# EAGLE design Thunderboard (EAGLE 9.2.2)
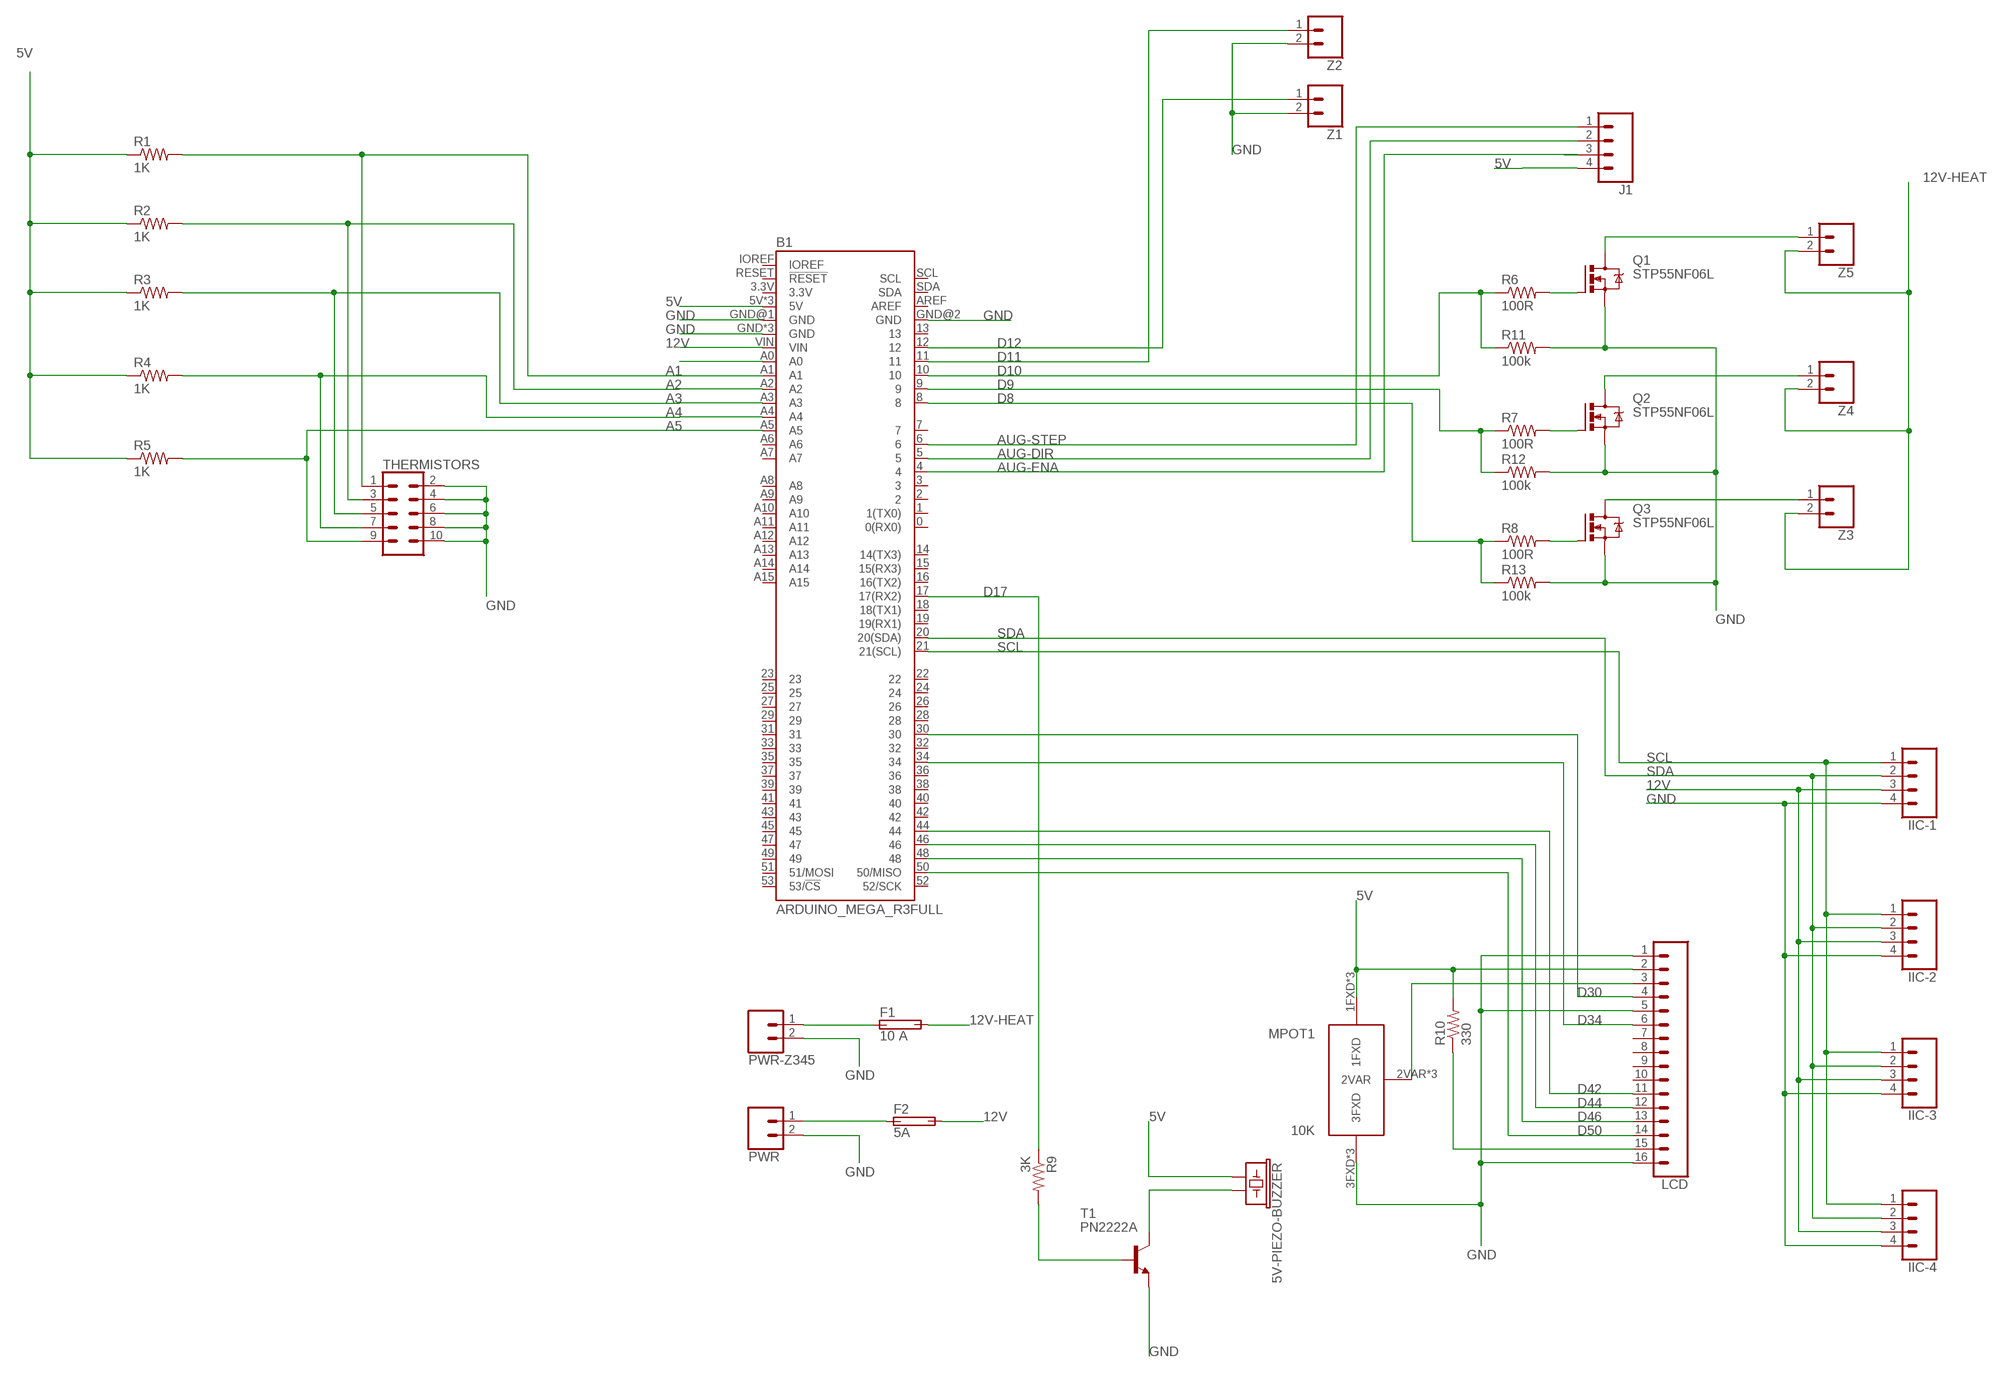
[diagram p0: schematic, sheet 1]

## Parts
5V-PIEZO-BUZZER  BUZZER-PTH  [BUZZER-12MM]
B1  ARDUINO_MEGA_R3FULL  [ARDUINO_MEGA_NO_SILK]
F1  10 A  BLADE-FUSE-HOLDER3557-15  [MINI-BLADE]
F2  5A  BLADE-FUSE-HOLDER3557-15  [MINI-BLADE]
IIC-1  CONN_04  [1X04]
IIC-2  CONN_04  [1X04]
IIC-3  CONN_04  [1X04]
IIC-4  CONN_04  [1X04]
J1  CONN_04  [1X04]
LCD  CONN_16  [1X16]
MPOT1  10K  POT-MULTI-PACKAGE  [POT-MULTI-PACKAGE]
PWR  CONN_023.5MM  [SCREWTERMINAL-3.5MM-2]
PWR-Z345  CONN_023.5MM  [SCREWTERMINAL-3.5MM-2]
Q1  STP55NF06L  [TO-220]
Q2  STP55NF06L  [TO-220]
Q3  STP55NF06L  [TO-220]
R1  1K  R-US_0207/7  [0207/7]
R2  1K  R-US_0207/7  [0207/7]
R3  1K  R-US_0207/7  [0207/7]
R4  1K  R-US_0207/7  [0207/7]
R5  1K  R-US_0207/7  [0207/7]
R6  100R  R-US_0207/7  [0207/7]
R7  100R  R-US_0207/7  [0207/7]
R8  100R  R-US_0207/7  [0207/7]
R9  3K  R-US_0207/7  [0207/7]
R10  330  R-US_0207/7  [0207/7]
R11  100k  R-US_0207/7  [0207/7]
R12  100k  R-US_0207/7  [0207/7]
R13  100k  R-US_0207/7  [0207/7]
T1  PN2222A  -NPN-TO92-EBC  [TO92-EBC]
THERMISTORS  CONN_05X2NO_SILK  [2X5_NOSILK]
Z1  CONN_02  [1X02]
Z2  CONN_02  [1X02]
Z3  CONN_023.5MM  [SCREWTERMINAL-3.5MM-2]
Z4  CONN_023.5MM  [SCREWTERMINAL-3.5MM-2]
Z5  CONN_023.5MM  [SCREWTERMINAL-3.5MM-2]

## Nets
5V: 5V-PIEZO-BUZZER.+ B1.5V B1.5V@1(5V) B1.5V@2(5V) J1.4 LCD.2 MPOT1.1FXD MPOT1.P$7(1FXD) MPOT1.P$8(1FXD) R1.1 R2.1 R3.1 R4.1 R5.1 R10.2
12V: B1.VIN F2.2A F2.2B IIC-1.3 IIC-2.3 IIC-3.3 IIC-4.3
12V-HEAT: F1.2A F1.2B Z3.2 Z4.2 Z5.2
A1: B1.A1 R1.2 THERMISTORS.1
A2: B1.A2 R2.2 THERMISTORS.3
A3: B1.A3 R3.2 THERMISTORS.5
A4: B1.A4 R4.2 THERMISTORS.7
A5: B1.A5 R5.2 THERMISTORS.9
AUG-DIR: B1.5 J1.2
AUG-ENA: B1.4 J1.3
AUG-STEP: B1.6 J1.1
D8: B1.8 R8.1 R13.1
D9: B1.9 R7.1 R12.1
D10: B1.10 R6.1 R11.1
D11: B1.11 Z2.1
D12: B1.12 Z1.1
D17: B1.17(17(RX2)) R9.1
D30: B1.30 LCD.4
D34: B1.34 LCD.6
D42: B1.44 LCD.11
D44: B1.46 LCD.12
D46: B1.48 LCD.13
D50: B1.50(50/MISO) LCD.14
GND: B1.GND B1.GND@1(GND) B1.GND@2(GND) B1.GND@3(GND) B1.GND@4(GND) IIC-1.4 IIC-2.4 IIC-3.4 IIC-4.4 LCD.1 LCD.5 LCD.16 MPOT1.3FXD MPOT1.P$4(3FXD) MPOT1.P$5(3FXD) PWR-Z345.2 PWR.2 Q1.S Q2.S Q3.S R11.2 R12.2 R13.2 T1.E THERMISTORS.2 THERMISTORS.4 THERMISTORS.6 THERMISTORS.8 THERMISTORS.10 Z1.2 Z2.2
N$1: 5V-PIEZO-BUZZER.- T1.C
N$2: R9.2 T1.B
N$3: Q1.G R6.2
N$4: Q2.G R7.2
N$5: Q3.G R8.2
N$6: LCD.3 MPOT1.2VAR MPOT1.P$1(2VAR) MPOT1.P$3(2VAR)
N$7: Q1.D Z5.1
N$8: B1.A0
N$9: Q2.D Z4.1
N$10: Q3.D Z3.1
N$11: F1.1A F1.1B PWR-Z345.1
N$12: LCD.15 R10.1
N$14: F2.1A F2.1B PWR.1
SCL: B1.21(21(SCL)) IIC-1.1 IIC-2.1 IIC-3.1 IIC-4.1
SDA: B1.20(20(SDA)) IIC-1.2 IIC-2.2 IIC-3.2 IIC-4.2
Unconnected: B1.0(0(RX0)) B1.1(1(TX0)) B1.2 B1.3 B1.3.3V B1.7 B1.13 B1.14(14(TX3)) B1.15(15(RX3)) B1.16(16(TX2)) B1.18(18(TX1)) B1.19(19(RX1)) B1.22 B1.23 B1.24 B1.25 B1.26 B1.27 B1.28 B1.29 B1.31 B1.32 B1.33 B1.35 B1.36 B1.37 B1.38 B1.39 B1.40 B1.41 B1.42 B1.43 B1.45 B1.47 B1.49 B1.51(51/MOSI) B1.52(52/SCK) B1.53(53/!CS) B1.A6 B1.A7 B1.A8 B1.A9 B1.A10 B1.A11 B1.A12 B1.A13 B1.A14 B1.A15 B1.AREF B1.IOREF B1.RESET(!RESET) B1.SCL B1.SDA LCD.7 LCD.8 LCD.9 LCD.10

## Library data of the parts
5V-PIEZO-BUZZER = SparkFun-Electromechanical:BUZZER: Buzzer Small round buzzers that operate around the audible 2kHz range. You can use these as speakers to create simple music or user interfaces. Variant Overview: PTH - Mini Speaker - PC Mount 12mm 2.048kHz <https://www.sparkfun.com/products/7950> PTH_KIT - Mini Speaker - PC Mount 12mm 2.048kHz <https://www.sparkfun.com/products/7950> KIT simplifies soldering by adding stop mask to one side of the pads. PTH_NO_SILK - Mini Speaker - PC Mount 12mm 2.048kHz <https://www.sparkfun.com/products/7950> No silkscreen indicator of buzzer outline. PTH_KIT_NO_SILK - Mini Speaker - PC Mount 12mm 2.048kHz <https://www.sparkfun.com/products/7950> KIT package w/o silkscreen SMD - Buzzer Audio Magnetic (CCV-084B16) SMD buzzer used on, e.g. the LilyPad Buzzer <https://www.sparkfun.com/products/8463> and RFID USB Reader <https://www.sparkfun.com/products/9963>. SMD_KIT - Buzzer Audio Magnetic (CCV-084B16) SMD Buzzer with elongated pins to make soldering easier. Used on the SparkFun Simon Says - Surface Mount Soldering Kit <https://www.sparkfun.com/products/10935>.; PROD_ID: COMP-08253; SF_SKU: COM-07950
B1 = SparkFun-Boards:ARDUINO_MEGA_R3: Arduino Mega R3 ATmega2560 R3 compatible footprint. SparkFun Products: Arduino Mega 2560 R3 <https://www.sparkfun.com/products/11061>
F1 F2 = Edited Parts:BLADE-FUSE-HOLDER: FUSE HOLDER automotive blade Little fuse 297 or 997 series fuses
IIC-1-IIC-4 J1 = SparkFun-Connectors:CONN_04: Multi connection point. Often used as Generic Header-pin footprint for 0.1 inch spaced/style header connections On any of the 0.1 inch spaced packages, you can populate with these: Break Away Headers - Straight <https://www.sparkfun.com/products/116> (PRT-00116) Break Away Male Headers - Right Angle <https://www.sparkfun.com/products/553> (PRT-00553) Female Headers <https://www.sparkfun.com/products/115> (PRT-00115) Break Away Headers - Machine Pin <https://www.sparkfun.com/products/117> (PRT-00117) Break Away Female Headers - Swiss Machine Pin <https://www.sparkfun.com/products/743> (PRT-00743) For SCREWTERMINALS and SPRING TERMINALS visit here: Screw Terimnals on SparkFun.com <https://www.sparkfun.com/search/results?term=Screw+Terminals> (5mm/3.5mm/2.54mm spacing) This device is also useful as a general connection point to wire up your design to another part of your project. Our various solder wires solder well into these plated through hole pads. Hook-Up Wire - Assortment (Stranded, 22 AWG) <https://www.sparkfun.com/products/11375> (PRT-11375) Hook-Up Wire - Assortment (Solid Core, 22 AWG) <https://www.sparkfun.com/products/11367> (PRT-11367) View the entire wire category on our website here <https://www.sparkfun.com/categories/141> Special notes: Molex polarized connector foot print use with SKU : PRT-08231 with associated crimp pins and housings. 1MM SMD Version SKU: PRT-10208; PROD_ID: CONN-09696
LCD = SparkFun-Connectors:CONN_16: Multi connection point. Often used as Generic Header-pin footprint for 0.1 inch spaced/style header connections On any of the 0.1 inch spaced packages, you can populate with these: Break Away Headers - Straight <https://www.sparkfun.com/products/116> (PRT-00116) Break Away Male Headers - Right Angle <https://www.sparkfun.com/products/553> (PRT-00553) Female Headers <https://www.sparkfun.com/products/115> (PRT-00115) Break Away Headers - Machine Pin <https://www.sparkfun.com/products/117> (PRT-00117) Break Away Female Headers - Swiss Machine Pin <https://www.sparkfun.com/products/743> (PRT-00743) For SCREWTERMINALS and SPRING TERMINALS visit here: Screw Terimnals on SparkFun.com <https://www.sparkfun.com/search/results?term=Screw+Terminals> (5mm/3.5mm/2.54mm spacing) This device is also useful as a general connection point to wire up your design to another part of your project. Our various solder wires solder well into these plated through hole pads. Hook-Up Wire - Assortment (Stranded, 22 AWG) <https://www.sparkfun.com/products/11375> (PRT-11375) Hook-Up Wire - Assortment (Solid Core, 22 AWG) <https://www.sparkfun.com/products/11367> (PRT-11367) View the entire wire category on our website here <https://www.sparkfun.com/categories/141> Special notes: Molex polarized connector foot print use with SKU : PRT-08231 with associated crimp pins and housings. 1MM SMD Version SKU: PRT-10208 NOTES ON THE VARIANTS LOCK and LOCK_LONGPADS... This footprint was designed to help hold the alignment of a through-hole component (i.e. 6-pin header) while soldering it into place. You may notice that each hole has been shifted either up or down by 0.005 of an inch from it's more standard position (which is a perfectly straight line). This slight alteration caused the pins (the squares in the middle) to touch the edges of the holes. Because they are alternating, it causes a "brace" to hold the component in place. 0.005 has proven to be the perfect amount of "off-center" position when using our standard breakaway headers. Although looks a little odd when you look at the bare footprint, once you have a header in there, the alteration is very hard to notice. Also,if you push a header all the way into place, it is covered up entirely on the bottom side.
MPOT1 = POT-MULTI-PACKAGE:POT-MULTI-PACKAGE
PWR PWR-Z345 Z3-Z5 = SparkFun-Connectors:CONN_02: Multi connection point. Often used as Generic Header-pin footprint for 0.1 inch spaced/style header connections On any of the 0.1 inch spaced packages, you can populate with these: Break Away Headers - Straight <https://www.sparkfun.com/products/116> (PRT-00116) Break Away Male Headers - Right Angle <https://www.sparkfun.com/products/553> (PRT-00553) Female Headers <https://www.sparkfun.com/products/115> (PRT-00115) Break Away Headers - Machine Pin <https://www.sparkfun.com/products/117> (PRT-00117) Break Away Female Headers - Swiss Machine Pin <https://www.sparkfun.com/products/743> (PRT-00743) For SCREWTERMINALS and SPRING TERMINALS visit here: Screw Terimnals on SparkFun.com <https://www.sparkfun.com/search/results?term=Screw+Terminals> (5mm/3.5mm/2.54mm spacing) This device is also useful as a general connection point to wire up your design to another part of your project. Our various solder wires solder well into these plated through hole pads. Hook-Up Wire - Assortment (Stranded, 22 AWG) <https://www.sparkfun.com/products/11375> (PRT-11375) Hook-Up Wire - Assortment (Solid Core, 22 AWG) <https://www.sparkfun.com/products/11367> (PRT-11367) View the entire wire category on our website here <https://www.sparkfun.com/categories/141> Special notes: Molex polarized connector foot print use with: PRT-08233 with associated crimp pins and housings. 2.54_SCREWTERM for use with PRT-10571. 3.5mm Screw Terminal footprints for PRT-08084 5mm Screw Terminal footprints for use with PRT-08432; PROD_ID: CONN-08399
Q1-Q3 = Edited Parts:STP55NF06L: HEXFET Power MOSFET
R1-R13 = resistor - edit:R-US_: RESISTOR, American symbol
T1 = transistor:*-NPN-: NPN Transistror BF959 corrected 2008.03.06
THERMISTORS = SparkFun-Connectors:CONN_05X2: Multi connection point. Often used as Generic Header-pin footprint for 0.1 inch spaced/style header connections For AVR SPI programming port, see special device with nice symbol: "AVR_SPI_PROG_5x2.dev" You can populate with any combo of single row headers, but if you'd like an exact match, check these: 2x5 AVR ICSP Male Header <https://www.sparkfun.com/products/778> (PRT-00778) 2x5 Pin Shrouded Header <https://www.sparkfun.com/products/8506> (PRT-08506) On any of the 0.1 inch spaced packages, you can populate with these: Break Away Headers - Straight <https://www.sparkfun.com/products/116> (PRT-00116) Break Away Male Headers - Right Angle <https://www.sparkfun.com/products/553> (PRT-00553) Female Headers <https://www.sparkfun.com/products/115> (PRT-00115) Break Away Headers - Machine Pin <https://www.sparkfun.com/products/117> (PRT-00117) Break Away Female Headers - Swiss Machine Pin <https://www.sparkfun.com/products/743> (PRT-00743) Special note: the shrouded connector mates well with our 5x2 ribbon cables: 2x5 Pin IDC Ribbon Cable <https://www.sparkfun.com/products/8535> (PRT-08535)
Z1 Z2 = SparkFun-Connectors:CONN_02: Multi connection point. Often used as Generic Header-pin footprint for 0.1 inch spaced/style header connections On any of the 0.1 inch spaced packages, you can populate with these: Break Away Headers - Straight <https://www.sparkfun.com/products/116> (PRT-00116) Break Away Male Headers - Right Angle <https://www.sparkfun.com/products/553> (PRT-00553) Female Headers <https://www.sparkfun.com/products/115> (PRT-00115) Break Away Headers - Machine Pin <https://www.sparkfun.com/products/117> (PRT-00117) Break Away Female Headers - Swiss Machine Pin <https://www.sparkfun.com/products/743> (PRT-00743) For SCREWTERMINALS and SPRING TERMINALS visit here: Screw Terimnals on SparkFun.com <https://www.sparkfun.com/search/results?term=Screw+Terminals> (5mm/3.5mm/2.54mm spacing) This device is also useful as a general connection point to wire up your design to another part of your project. Our various solder wires solder well into these plated through hole pads. Hook-Up Wire - Assortment (Stranded, 22 AWG) <https://www.sparkfun.com/products/11375> (PRT-11375) Hook-Up Wire - Assortment (Solid Core, 22 AWG) <https://www.sparkfun.com/products/11367> (PRT-11367) View the entire wire category on our website here <https://www.sparkfun.com/categories/141> Special notes: Molex polarized connector foot print use with: PRT-08233 with associated crimp pins and housings. 2.54_SCREWTERM for use with PRT-10571. 3.5mm Screw Terminal footprints for PRT-08084 5mm Screw Terminal footprints for use with PRT-08432

## Net classes
0 default: width 0.508 mm, drill 0.635 mm, clearance 0.508 mm
1 ground: width 0.254 mm

## Board
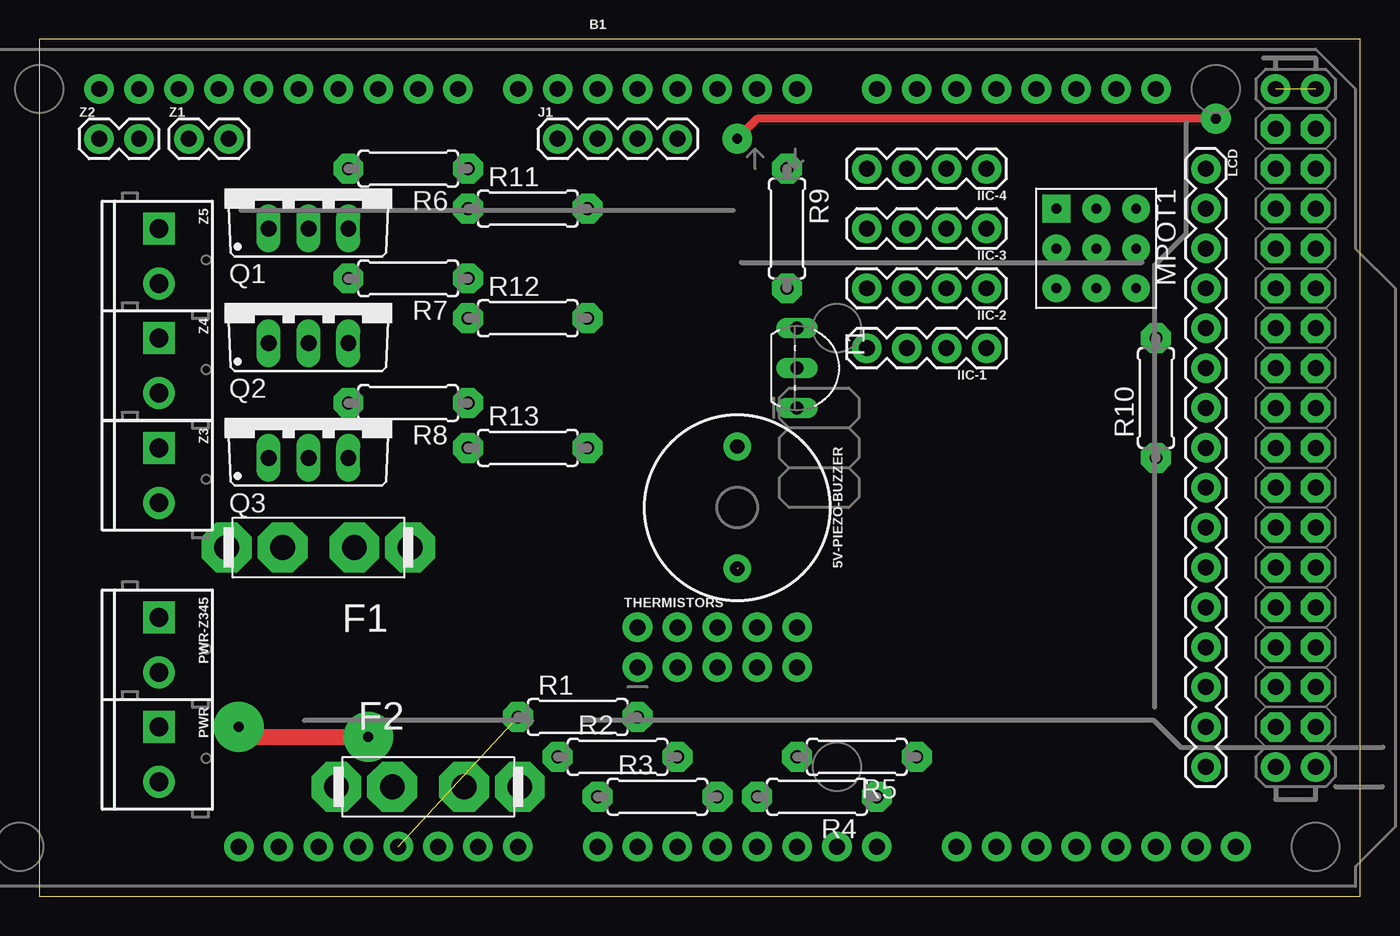
[diagram p1: board, top side]
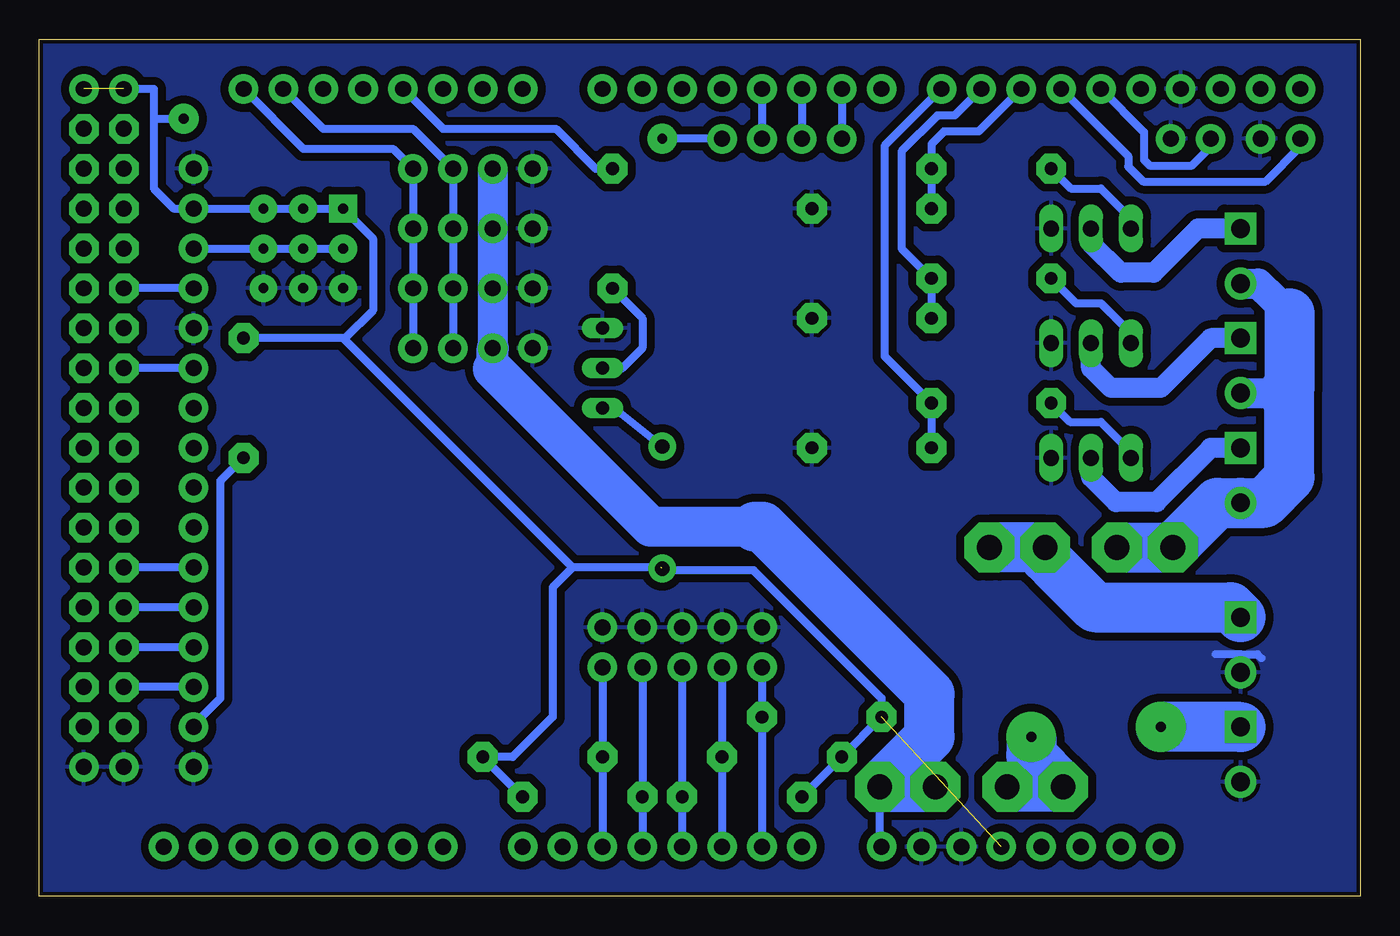
[diagram p2: board, bottom side, seen from below]

Size 84.12 x 54.6 mm. Coordinates in mm from the lower left corner, seen from the top.
Outline: 0,0 84.12,0 84.12,54.6 0,54.6 0,0
Copper layers (1*16): Top 0.035mm / dielectric 1.5mm / Bottom 0.035mm
Design rules "default *": minimum track width 6mil, minimum drill 0.35mm, track to track 6mil, track to pad 6mil, pad to pad 6mil, via to via 6mil, smd to smd 6mil, copper to edge 10mil, drill to drill 6mil, minimum pad ring 10mil, minimum via ring 8mil, stop-mask expansion 4mil, vias tented up to drill 0mil, thermal gap 10mil

### Footprints (pad centres in the part's own frame; a part is rotated, then mirrored left to right if it is on the bottom)
BUZZER-12MM = drill 0.9 pad 1.778: + 3.885,0; - -3.885,0
ARDUINO_MEGA_NO_SILK = drill 1.016 pad 1.88: 0 13.97,24.13; 1 11.43,24.13; 2 8.89,24.13; 3 6.35,24.13; 3.3V -13.97,-24.13; 4 3.81,24.13; 5 1.27,24.13; 5V -11.43,-24.13; 5V@1 44.45,24.13; 5V@2 46.99,24.13; 6 -1.27,24.13; 7 -3.81,24.13; 8 -7.62,24.13; 9 -10.16,24.13; 10 -12.7,24.13; 11 -15.24,24.13; 12 -17.78,24.13; 13 -20.32,24.13; 14 19.05,24.13; 15 21.59,24.13; 16 24.13,24.13; 17 26.67,24.13; 18 29.21,24.13; 19 31.75,24.13; 20 34.29,24.13; 21 36.83,24.13; A0 1.27,-24.13; A1 3.81,-24.13; A2 6.35,-24.13; A3 8.89,-24.13; A4 11.43,-24.13; A5 13.97,-24.13; A6 16.51,-24.13; A7 19.05,-24.13; A8 24.13,-24.13; A9 26.67,-24.13; A10 29.21,-24.13; A11 31.75,-24.13; A12 34.29,-24.13; A13 36.83,-24.13; A14 39.37,-24.13; A15 41.91,-24.13; AREF -25.4,24.13; GND -8.89,-24.13; GND@1 -6.35,-24.13; GND@2 44.45,-19.05; GND@3 46.99,-19.05; GND@4 -22.86,24.13; IOREF -19.05,-24.13; NC -21.59,-24.13; RESET -16.51,-24.13; SCL -30.48,24.13; SDA -27.94,24.13; VIN -3.81,-24.13 | drill 1.016 pad 1.88 octagon: 22 44.45,21.59; 23 46.99,21.59; 24 44.45,19.05; 25 46.99,19.05; 26 44.45,16.51; 27 46.99,16.51; 28 44.45,13.97; 29 46.99,13.97; 30 44.45,11.43; 31 46.99,11.43; 32 44.45,8.89; 33 46.99,8.89; 34 44.45,6.35; 35 46.99,6.35; 36 44.45,3.81; 37 46.99,3.81; 38 44.45,1.27; 39 46.99,1.27; 40 44.45,-1.27; 41 46.99,-1.27; 42 44.45,-3.81; 43 46.99,-3.81; 44 44.45,-6.35; 45 46.99,-6.35; 46 44.45,-8.89; 47 46.99,-8.89; 48 44.45,-11.43; 49 46.99,-11.43; 50 44.45,-13.97; 51 46.99,-13.97; 52 44.45,-16.51; 53 46.99,-16.51
MINI-BLADE = drill 1.575 pad 3.175 octagon: 1A -2.286,0; 1B -5.842,0; 2A 2.286,0; 2B 5.842,0
1X04 = drill 1.016 pad 1.88: 1 0,0; 2 2.54,0; 3 5.08,0; 4 7.62,0
1X16 = drill 1.016 pad 1.88: 1 0,0; 2 2.54,0; 3 5.08,0; 4 7.62,0; 5 10.16,0; 6 12.7,0; 7 15.24,0; 8 17.78,0; 9 20.32,0; 10 22.86,0; 11 25.4,0; 12 27.94,0; 13 30.48,0; 14 33.02,0; 15 35.56,0; 16 38.1,0
POT-MULTI-PACKAGE = drill 0.635 pad 1.778 square: 1FXD -2.54,-2.54 | drill 0.635 pad 1.778: 2VAR 0,-2.54; 3FXD 2.54,-2.54; P$1 0,0; P$3 0,2.54; P$4 2.54,2.54; P$5 2.54,0; P$7 -2.54,2.54; P$8 -2.54,0
SCREWTERMINAL-3.5MM-2 = drill 1.2 pad 2.032 square: 1 0,0 | drill 1.2 pad 2.032: 2 3.5,0
TO-220 = drill 1.016 long: D 0,-2.54; G -2.54,-2.54; S 2.54,-2.54
0207/7 = drill 0.813 pad 1.905 octagon: 1 -3.81,0; 2 3.81,0
TO92-EBC = drill 0.813 long: B 0,-1.27; C 2.54,-1.27; E -2.54,-1.27
2X5_NOSILK = drill 1.016 pad 1.88: 1 0,0; 2 0,2.54; 3 2.54,0; 4 2.54,2.54; 5 5.08,0; 6 5.08,2.54; 7 7.62,0; 8 7.62,2.54; 9 10.16,0; 10 10.16,2.54
1X02 = drill 1.016 pad 1.88: 1 0,0; 2 2.54,0

### Placement (x,y rotation side)
5V-PIEZO-BUZZER  44.45,24.77 270 top
B1  34.29,27.3 0 top
F1  17.78,22.23 180 top
F2  24.77,6.99 0 top
IIC-1  60.33,34.92 180 top
IIC-2  60.33,38.73 180 top
IIC-3  60.33,42.55 180 top
IIC-4  60.33,46.35 180 top
J1  33.02,48.26 0 top
LCD  74.3,46.35 270 top
MPOT1  67.31,41.27 270 top
PWR  7.62,10.79 270 top
PWR-Z345  7.62,17.78 270 top
Q1  17.14,45.09 0 top
Q2  17.14,37.78 0 top
Q3  17.14,30.48 0 top
R1  34.29,11.43 0 top
R2  36.83,8.89 0 top
R3  39.37,6.35 0 top
R4  49.53,6.35 180 top
R5  52.07,8.89 180 top
R6  23.5,46.35 180 top
R7  23.5,39.37 180 top
R8  23.5,31.43 180 top
R9  47.62,42.55 270 top
R10  71.12,31.75 90 top
R11  31.11,43.81 0 top
R12  31.11,36.83 0 top
R13  31.11,28.57 0 top
T1  49.53,33.66 270 top
THERMISTORS  38.1,14.61 0 top
Z1  9.53,48.26 0 top
Z2  3.81,48.26 0 top
Z3  7.62,28.57 270 top
Z4  7.62,35.56 270 top
Z5  7.62,42.55 270 top

### Tracks (layer width: path | path; a pad name or v marks a point on that pad's centre or on a via)
5V  (via drill 0.64 pad 1.91)  (3 unrouted)
  Top 0.508: v74.93,49.53 45.72,49.53 v44.45,48.26
  Bottom 0.508: R3.1 R2.1 R1.1 30.48,12.62 38.63,20.78 44.35,20.78 44.52,20.95 50.16,20.95 | R4.1 R5.1 53.98,8.89 51.44,11.43 51.44,19.68 50.16,20.95 | B1.5V@1 76.83,51.44 76.83,49.53 | 76.83,49.53 76.83,45.09 75.56,43.81 LCD.2 MPOT1.P$7 MPOT1.P$8 MPOT1.1FXD 62.87,41.91 62.87,37.33 64.64,35.56 64.77,35.56 | 64.77,35.56 R10.2 | 50.16,20.95 64.77,35.56 | 76.83,49.53 v74.93,49.53 | J1.4 v44.45,48.26
12V
  Bottom 0.508: F2.2B 30.61,3.3 B1.VIN
  Bottom 1.905: IIC-4.3 IIC-3.3 IIC-2.3 IIC-1.3
  Bottom 2.032: 55.24,33.62 IIC-1.3
  Bottom 2.54: 38.54,23.55 45.17,23.55 55.24,33.62
  Bottom 3.175: F2.2A F2.2B 27.43,10.17 27.43,12.9 38.08,23.55 38.54,23.55
12V-HEAT
  Bottom 1.905: 4.51,37.14 6.5,39.05 Z5.2 | Z4.2 4.92,32.06
  Bottom 3.175: F1.2A F1.2B 9.09,25.07 Z3.2 6.12,25.07 4.51,26.69 4.51,32.38 | 4.51,37.14 4.51,32.38 | 4.92,32.06 4.51,32.38
A1
  Bottom 0.508: THERMISTORS.1 R1.2 B1.A1
A2
  Bottom 0.508: THERMISTORS.3 R2.2 B1.A2
A3
  Bottom 0.508: THERMISTORS.5 R3.2 B1.A3
A4
  Bottom 0.508: THERMISTORS.7 R4.2 B1.A4
A5
  Bottom 0.508: THERMISTORS.9 R5.2 B1.A5
AUG-DIR
  Bottom 0.508: B1.5 J1.2
AUG-ENA
  Bottom 0.508: B1.4 J1.3
AUG-STEP
  Bottom 0.508: B1.6 J1.1
D8
  Bottom 0.508: B1.8 30.29,47.82 30.29,34.42 R8.1 R13.1
D9
  Bottom 0.508: R12.1 R7.1 29.21,41.27 29.21,47.46 26.93,49.73 25.83,49.73 B1.9
D10
  Bottom 0.508: R6.1 26.67,46.35 | R6.1 R11.1 | B1.10 24.31,48.72 26.51,48.72 27.3,47.93 R6.1
D11
  Bottom 0.508: Z2.1 3.81,47.76 6.03,45.54 13.83,45.54 14.78,46.5 14.78,47.17 B1.11
D12
  Bottom 0.508: B1.12 13.77,48.69 13.77,46.92 13.4,46.56 10.72,46.56 9.53,47.76 Z1.1
D17
  Bottom 0.508: B1.17 58.42,48.9 51.22,48.9 48.68,46.35 R9.1
D30
  Bottom 0.508: LCD.4 B1.30
D34
  Bottom 0.508: LCD.6 B1.34
D42
  Bottom 0.508: LCD.11 B1.44
D44
  Bottom 0.508: LCD.12 B1.46
D46
  Bottom 0.508: LCD.13 B1.48
D50
  Bottom 0.508: LCD.14 B1.50
GND
  Bottom 0.508: PWR-Z345.2 7.62,15.43 | 7.62,15.43 9.23,15.43 | 7.62,15.43 6.54,15.43 6.28,15.17
  pour Bottom: 0,0 0,54.61 83.82,54.61 83.82,0
N$1
  Bottom 0.508: T1.C 47.69,31.24 5V-PIEZO-BUZZER.-
N$2
  Bottom 0.508: R9.2 45.72,36.83 45.72,34.92 46.99,33.66 T1.B
N$3
  Bottom 0.508: R6.2 18.41,45.09 16.51,45.09 14.61,43.18 Q1.G
N$4
  Bottom 0.508: R7.2 18.1,37.78 16.51,37.78 14.61,35.88 Q2.G
N$5
  Bottom 0.508: Q3.G 14.61,28.32 16.51,30.23 18.48,30.23 R8.2
N$6
  Bottom 0.508: MPOT1.2VAR MPOT1.P$1 MPOT1.P$3 LCD.3
N$7
  Bottom 1.27: Z5.1 10.33,42.55 13.15,39.73 15.24,39.73 17.14,41.63 Q1.D
N$9
  Bottom 1.27: Z4.1 9.53,35.56 12.7,32.38 15.88,32.38 17.14,33.66 Q2.D
N$10
  Bottom 1.27: Z3.1 9.53,28.57 12.98,25.12 15.56,25.12 17.14,26.71 Q3.D
N$11
  Bottom 3.175: PWR-Z345.1 8.26,18.41 16.89,18.41 19.18,20.7 20.07,21.59 F1.1A F1.1B
N$12
  Bottom 0.508: R10.1 72.59,26.47 72.59,12.63 74.3,10.93 LCD.15
N$14  (via drill 0.64 pad 3.17)
  Top 1.016: v12.7,10.79 13.34,10.16 v20.95,10.16
  Bottom 3.175: PWR.1 v12.7,10.79 | v20.95,10.16 20.95,9.02 F2.1B F2.1A
SCL
  Bottom 0.508: B1.21 67.31,47.62 61.59,47.62 IIC-4.1 IIC-3.1 IIC-2.1 IIC-1.1
SDA
  Bottom 0.508: B1.20 66.04,48.9 60.33,48.9 IIC-4.2 IIC-3.2 IIC-2.2 IIC-1.2